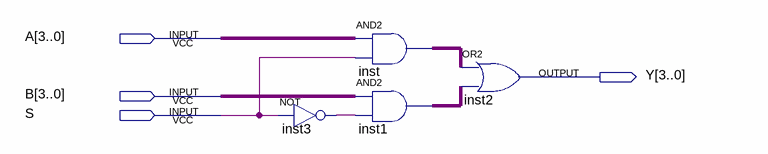
[diagram p0: schematic sheet]
// Quartus schematic 4mux21.bdf as structural Verilog: 4 symbols, 4 pins
module \4mux21  (
  input  [3:0] A,
  input  [3:0] B,
  input  S,
  output [3:0] Y
);

  wire inst3_out;
  wire [3:0] inst1_out, inst_out;

  not inst3 (inst3_out, S);
  assign inst_out = A & {4{S}};  // AND2 inst, 4 bits wide
  assign inst1_out = B & {4{inst3_out}};  // AND2 inst1, 4 bits wide
  assign Y = inst_out | inst1_out;  // OR2 inst2, 4 bits wide
endmodule
